# Altium schematic sheet 50x80_Crystal_Filter_with_Amp.SchDoc
size A
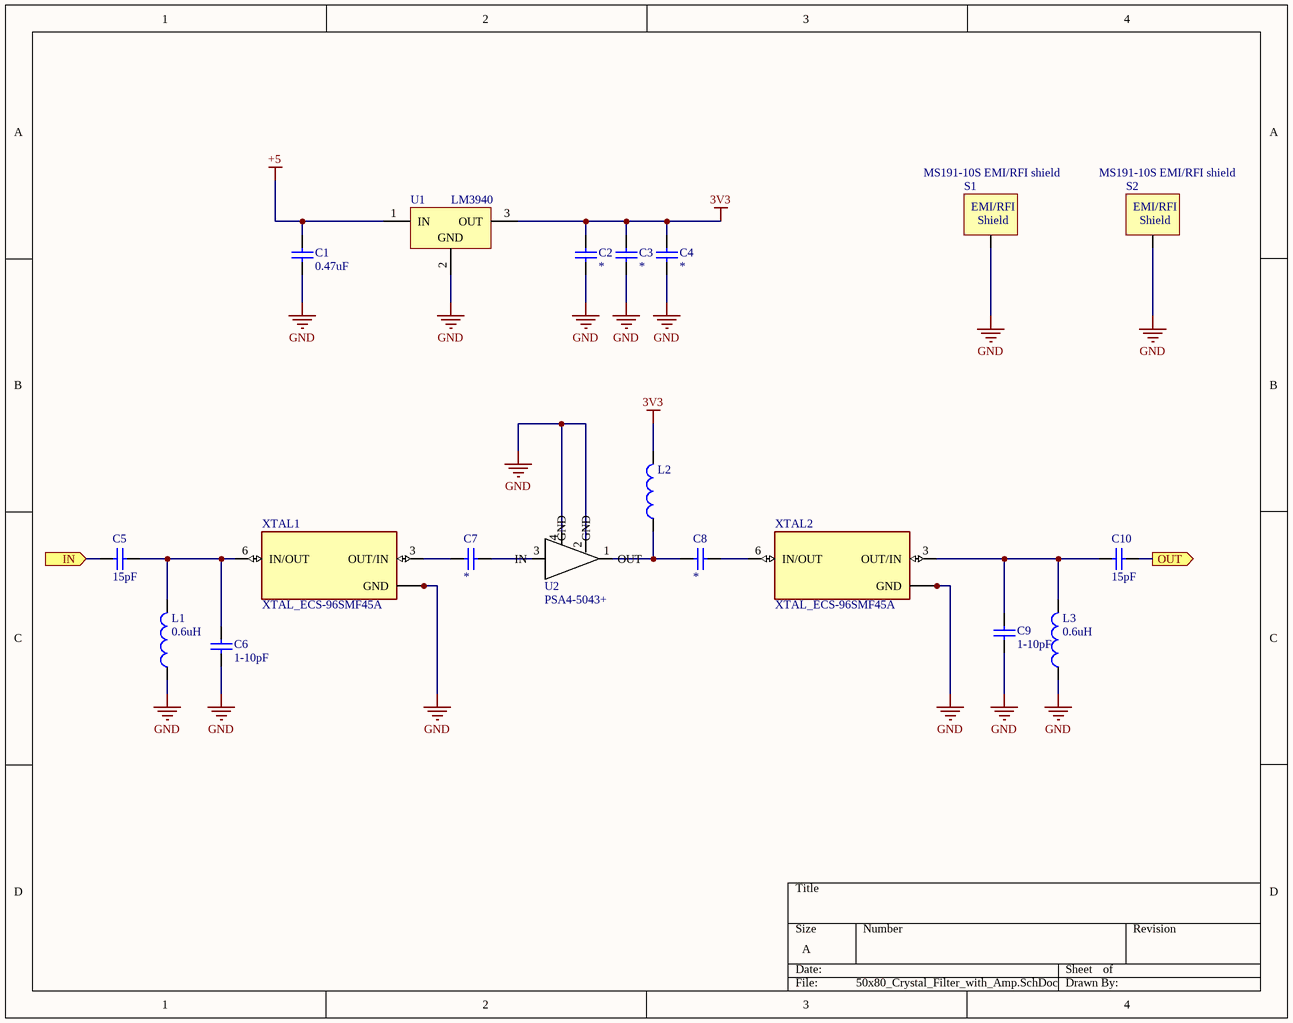
[diagram p0: 50x80_Crystal_Filter_with_Amp.SchDoc]

## Parts
C1  value 0.47uF  [0805]  (hidden comment: Cap_0805)
C2  Cap_1206  [1206]  (value not drawn)
C3  Cap_1206  [1206]  (value not drawn)
C4  Cap_1206  [1206]  (value not drawn)
C5  value 15pF  [0805]  (hidden comment: Cap_0805)
C6  value 1-10pF  [0805]  (hidden comment: Cap_0805)
C7  Cap_1206  [1206]  (value not drawn)
C8  Cap_1206  [1206]  (value not drawn)
C9  value 1-10pF  [0805]  (hidden comment: Cap_0805)
C10  value 15pF  [0805]  (hidden comment: Cap_0805)
L1  value 0.6uH  [0805]  (hidden comment: IND_0805)
L2  IND_1206  [1206]  (value not drawn)
L3  value 0.6uH  [0805]  (hidden comment: IND_0805)
S1  MS191-10S EMI/RFI shield  [MS191-10S]
S2  MS191-10S EMI/RFI shield  [MS191-10S]
U1  LM3940  [TI-DCY4_N]
U2  PSA4-5043+  [PSA4-5043+]
XTAL1  XTAL_ECS-96SMF45A  [XTAL_ECS-96SMF45A30-TR]
XTAL2  XTAL_ECS-96SMF45A  [XTAL_ECS-96SMF45A30-TR]

## Ports
IN (in), OUT (out)

## Nets
3V3: C2.1 C3.1 C4.1 L2.2 U1.3(OUT)
+5: C1.2 U1.1(IN)
GND: C1.1 C2.2 C3.2 C4.2 C6.1 C9.1 L1.1 L3.1 S1.0 S2.0 U1.2(GND) U2.2(GND) U2.4(GND) XTAL1.1(GND) XTAL1.2(GND) XTAL1.4(GND) XTAL1.5(GND) XTAL2.1(GND) XTAL2.2(GND) XTAL2.4(GND) XTAL2.5(GND)
IN: C5.1 ; port IN
OUT: C10.2 ; port OUT
NetC5_2: C5.2 C6.2 L1.2 XTAL1.6(IN/OUT)
NetC7_1: C7.1 XTAL1.3(OUT/IN)
NetC7_2: C7.2 U2.3(IN)
NetC8_1: C8.1 L2.1 U2.1(OUT)
NetC8_2: C8.2 XTAL2.6(IN/OUT)
NetC9_2: C9.2 C10.1 L3.2 XTAL2.3(OUT/IN)

## Notes on the sheet
- (in symbol MS191-10S) EMI/RFI; Shield

## Library data of the parts
C1 C5 C6 C9 C10 = Cap_0805: ABE_Capacitor; Ozdisan Link: *; Ozdisan P/N: *; DigiKey P/N: *; DigiKey Link: *; Package: 0805
C2-C4 C7 C8 = Cap_1206: ABE_Capacitor; Ozdisan Link: *; Ozdisan P/N: *; DigiKey P/N: *; DigiKey Link: *; Package: 1206; Value: *
L1 L3 = IND_0805: ABE_Inductor; Ozdisan Link: *; Ozdisan P/N: *; DigiKey P/N: *; DigiKey Link: *; Package: 0805
L2 = IND_1206: ABE_Inductor; Ozdisan Link: *; Ozdisan P/N: *; DigiKey P/N: *; DigiKey Link: *; Package: 1206
S1 S2 = MS191-10S: EMI/RFI shield MS191-10S
U1 = LM3940: 3-Terminal Positive Regulator; des: LM3940 1-A Low-Dropout Regulator for 5-V to 3.3-V Conversion
XTAL1 XTAL2 = XTAL_ECS-96SMF45A: 45MHz SMD Crystal Filter; XTAL: 45MHz
U2 = PSA4-5043+: Part Number: *; Part Link: *; Package: *